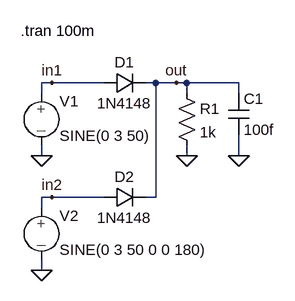
[diagram p0: schematic gleichrichter_2.asc]
gleichrichter_2.asc, the LTspice schematic file:
Version 4
SHEET 1 880 680
WIRE 80 144 64 144
WIRE 160 144 80 144
WIRE 240 144 224 144
WIRE 272 144 240 144
WIRE 288 144 272 144
WIRE 368 144 288 144
WIRE 64 160 64 144
WIRE 288 160 288 144
WIRE 368 160 368 144
WIRE 64 256 64 240
WIRE 288 256 288 240
WIRE 368 256 368 224
WIRE 80 320 64 320
WIRE 160 320 80 320
WIRE 240 320 240 144
WIRE 240 320 224 320
WIRE 64 336 64 320
WIRE 64 432 64 416
FLAG 288 256 0
FLAG 64 256 0
FLAG 80 144 in1
FLAG 272 144 out
FLAG 368 256 0
FLAG 64 432 0
FLAG 80 320 in2
SYMBOL source-V 64 144 R0
WINDOW 123 0 0 Left 2
WINDOW 39 0 0 Left 2
SYMATTR InstName V1
SYMATTR Value SINE(0 3 50)
SYMBOL res 272 144 R0
SYMATTR InstName R1
SYMATTR Value 1k
SYMBOL diode 160 160 R270
WINDOW 0 32 32 VTop 2
WINDOW 3 0 32 VBottom 2
SYMATTR InstName D1
SYMATTR Value 1N4148
SYMBOL cap 352 160 R0
SYMATTR InstName C1
SYMATTR Value 100f
SYMBOL source-V 64 320 R0
WINDOW 123 0 0 Left 2
WINDOW 39 0 0 Left 2
SYMATTR InstName V2
SYMATTR Value SINE(0 3 50 0 0 180)
SYMBOL diode 160 336 R270
WINDOW 0 32 32 VTop 2
WINDOW 3 0 32 VBottom 2
SYMATTR InstName D2
SYMATTR Value 1N4148
TEXT 32 64 Left 2 !.tran 100m

The netlist it stands for:
* gleichrichter_2.asc
V1 in1 0 SINE(0 3 50)
R1 out 0 1k
D1 in1 out 1N4148
C1 out 0 100f
V2 in2 0 SINE(0 3 50 0 0 180)
D2 in2 out 1N4148
.model D D
.lib standard.dio
.tran 100m
.backanno
.end